# Altium schematic sheet xds100v2.SchDoc
size A4
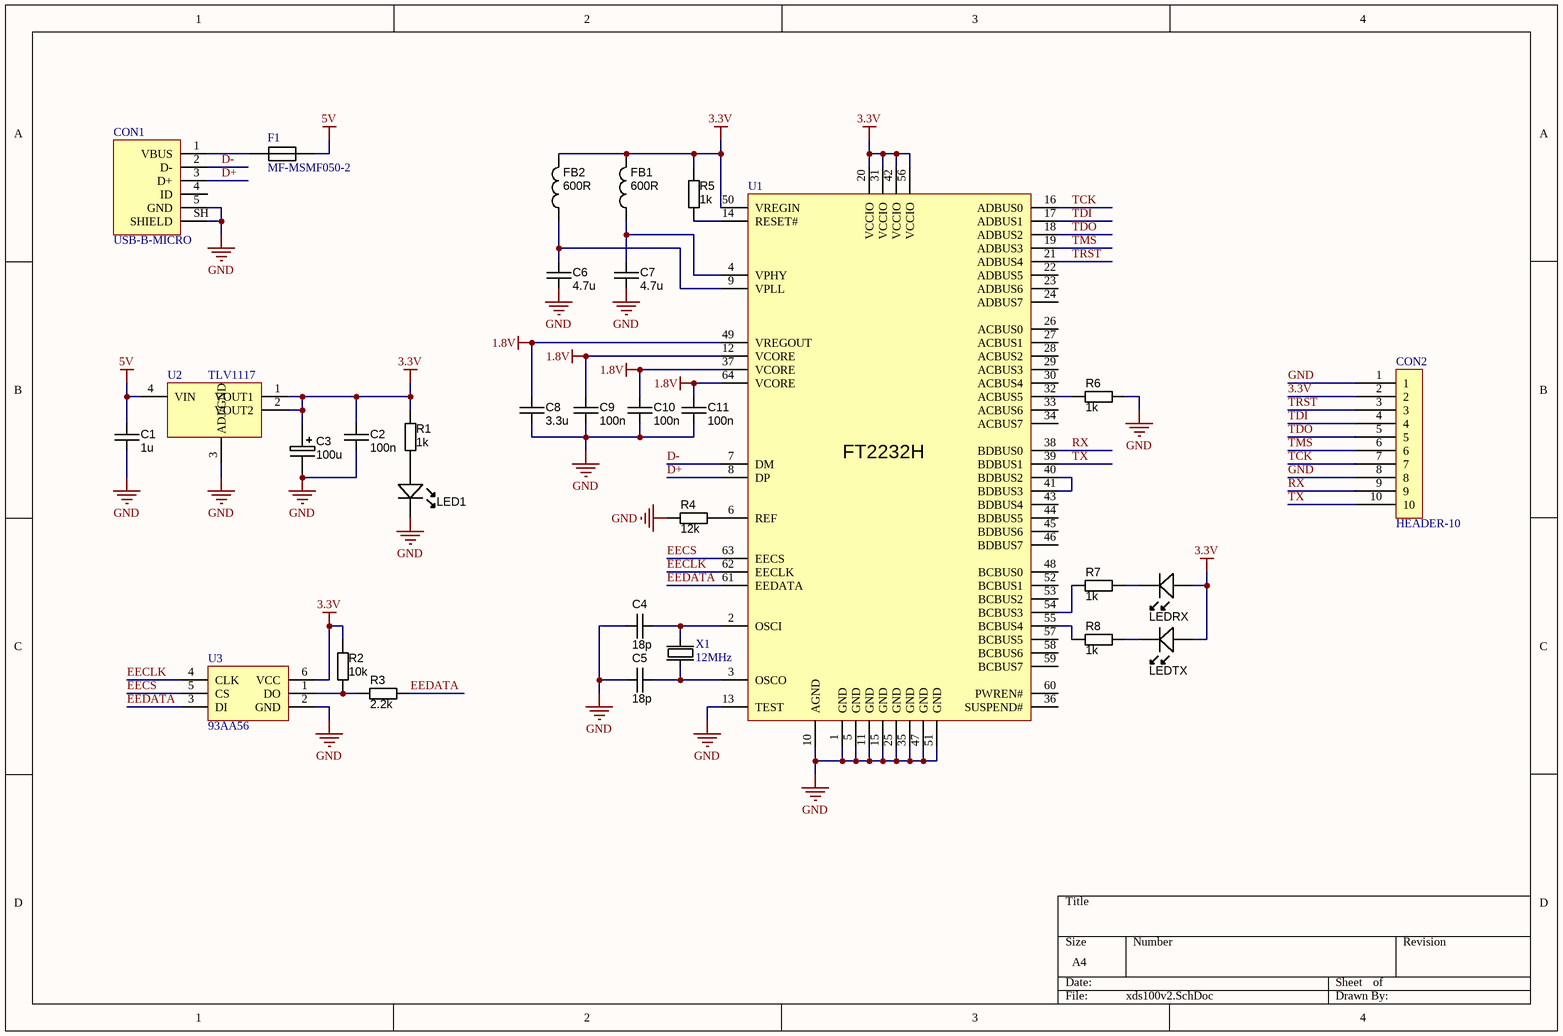
[diagram p0: xds100v2.SchDoc]

## Parts
C1  1u  [CAPC1608X90N]
C2  100n  [CAPC1608X90N]
C3  100u  [CAPMP3528X210N]
C4  18p  [CAPC1608X90N]
C5  18p  [CAPC1608X90N]
C6  4.7u  [CAPC1608X90N]
C7  4.7u  [CAPC1608X90N]
C8  3.3u  [CAPC1608X90N]
C9  100n  [CAPC1608X90N]
C10  100n  [CAPC1608X90N]
C11  100n  [CAPC1608X90N]
CON1  USB-B-MICRO  [USB-B-MICRO-FCI-10104110]
CON2  HEADER-10  [MICRO-MATCH-10]
F1  MF-MSMF050-2  [PTC-1218]
FB1  600R  [INDC1608N]
FB2  600R  [INDC1608N]
LED1  Green  [LED-0603-GREEN]  (value not drawn)
LEDRX  Green  [LED-0603-GREEN]  (value not drawn)
LEDTX  Green  [LED-0603-GREEN]  (value not drawn)
R1  1k  [RESC1608X55N]
R2  10k  [RESC1608X55N]
R3  2.2k  [RESC1608X55N]
R4  12k  [RESC1608X55N]
R5  1k  [RESC1608X55N]
R6  1k  [RESC1608X55N]
R7  1k  [RESC1608X55N]
R8  1k  [RESC1608X55N]
U1  FT2232H  [TSQFP50P1200X1200X160-64N]  (value not drawn)
U2  TLV1117  [SOT223]
U3  93AA56  [TSOT-23-6]
X1  12MHz  [XTAL-5x3.2]

## Nets
1.8V: C8.1 C9.2 C10.2 C11.2 U1.12(VCORE) U1.37(VCORE) U1.49(VREGOUT) U1.64(VCORE)
3.3V: C2.1 C3.1 CON2.2 FB1.2 FB2.2 LEDRX.A LEDTX.A R1.2 R2.2 R5.2 U1.20(VCCIO) U1.31(VCCIO) U1.42(VCCIO) U1.50(VREGIN) U1.56(VCCIO) U2.1(VOUT1) U2.2(VOUT2) U3.6(VCC)
5V: C1.2 F1.22 U2.4(VIN)
GND: C1.1 C2.2 C3.2 C4.2 C5.2 C6.2 C7.1 C8.2 C9.1 C10.1 C11.1 CON1.5(GND) CON1.SH(SHIELD) CON2.1 CON2.8 LED1.K R4.2 R6.2 U1.1(GND) U1.5(GND) U1.10(AGND) U1.11(GND) U1.13(TEST) U1.15(GND) U1.25(GND) U1.35(GND) U1.47(GND) U1.51(GND) U2.3(ADJ/GND) U3.2(GND)
D+: CON1.3(D+) U1.8(DP)
D-: CON1.2(D-) U1.7(DM)
EECLK: U1.62(EECLK) U3.4(CLK)
EECS: U1.63(EECS) U3.5(CS)
EEDATA: R3.1 U1.61(EEDATA) U3.3(DI)
RX: CON2.9 U1.38(BDBUS0)
TCK: CON2.7 U1.16(ADBUS0)
TDI: CON2.4 U1.17(ADBUS1)
TDO: CON2.5 U1.18(ADBUS2)
TMS: CON2.6 U1.19(ADBUS3)
TRST: CON2.3 U1.21(ADBUS4)
TX: CON2.10 U1.39(BDBUS1)
NetC4_1: C4.1 U1.2(OSCI) X1.1
NetC5_1: C5.1 U1.3(OSCO) X1.2
NetC6_1: C6.1 FB2.1 U1.9(VPLL)
NetC7_2: C7.2 FB1.1 U1.4(VPHY)
NetCON1_1: CON1.1(VBUS) F1.21
NetLED1_A: LED1.A R1.1
NetLEDRX_K: LEDRX.K R7.2
NetLEDTX_K: LEDTX.K R8.2
NetR2_1: R2.1 R3.2 U3.1(DO)
NetR4_1: R4.1 U1.6(REF)
NetR5_1: R5.1 U1.14(RESET#)
NetR6_1: R6.1 U1.32(ACBUS5)
NetR7_1: R7.1 U1.54(BCBUS3)
NetR8_1: R8.1 U1.55(BCBUS4)
NetU1_40: U1.40(BDBUS2) U1.41(BDBUS3)

Not connected (* = marked no-connect by the designer): CON1 4(ID); U1 22(ADBUS5) 23(ADBUS6) 24(ADBUS7) 26(ACBUS0) 27(ACBUS1) 28(ACBUS2) 29(ACBUS3) 30(ACBUS4) 33(ACBUS6) 34(ACBUS7) 36(SUSPEND#) 43(BDBUS4) 44(BDBUS5) 45(BDBUS6) 46(BDBUS7) 48(BCBUS0) 52(BCBUS1) 53(BCBUS2) 57(BCBUS5) 58(BCBUS6) 59(BCBUS7) 60(PWREN#)

## Library data of the parts
C1 C2 C4-C11 = CAPC_1u_0603_X7R_16V_10%: Capacitor SMD Cer 1uF 10% 16V X7R 0603; Manufacturer 1: TDK Corporation; Manufacturer Part Number 1: C1608X7R1C105K; Ratings: 16V; X7R; Material: ceramic; SCDType: spec; Value: 1µ; Package / Case: 0603 (1608 metric); Tolerance: ±10%; Supplier 1: Digi-Key; Supplier Part Number 1: 445-1604-1-ND; ComponentLink1URL: http://product.tdk.com/capacitor/mlcc/en/documents/mlcc_commercial_general_en.pdf; ComponentLink1Description: http://product.tdk.com/capacitor/mlcc/en/documents/mlcc_commercial_general_en.pdf
C3 = CAPT_100u_1210_6V3: Capacitor SMD Tantalum 100uF 20% 6.3V 1210; Manufacturer 1: AVX Corporation; Manufacturer Part Number 1: TCJB107M006R0045; Ratings: 6V3; Value: 100µ; SCDType: spec; Package / Case: 1210 (3528 Metric); Tolerance: ±20%; Material: Tantalum; Supplier 1: Digi-Key; Supplier Part Number 1: 478-4711-1-ND
F1 = MF-MSMF050-2: pin to pad: 21>1 22>2
FB1 FB2 = FERRITE_120R-100MHz_0603: Ferrite bead 120 Ohm at 100 MHz 2A 0603 SMD; Manufacturer 1: Murata Electronics North America; Manufacturer Part Number 1: BLM18PG121SN1D; Current: 900mA; DC Resistance (DCR): 172.9 mOhm Max; Frequency - Self Resonant: 23MHz; Frequency - Test: 100kHz; Impedance @ Frequency: 120 Ohm @ 100MHz; Filter Type: Differential Mode - Single; Number of Lines: 1; Ratings: 2 A; 50 mO DC; Value: 120R @ 100 MHz; SCDType: source; Current - Saturation: 900mA; Current - Temperature Rise: 900mA; Applications: Power Supplies; Package / Case: 1210 (3225 Metric); Operating Temperature: -40°C ~ 105°C; ComponentLink1URL: http://www.yuden.co.jp/ut/product/pdf/wound02_e.pdf; ComponentLink1Description: http://www.yuden.co.jp/ut/product/pdf/wound02_e.pdf; Supplier 1: Digi-Key; Supplier Part Number 1: 490-1037-1-ND; Current Rating: 2A; Mounting Type: Surface Mount; Height (Max): 0.037" (0.95mm); Size / Dimension: 0.063" L x 0.031" W (1.60mm x 0.80mm); ComponentLink2URL: http://search.murata.co.jp/Ceramy/image/img/PDF/ENG/L0110S0100BLM18P.pdf; ComponentLink2Description: http://search.murata.co.jp/Ceramy/image/img/PDF/ENG/L0110S0100BLM18P.pdf
LED1 = LED_SMD_Green_0603_570nm: LED 0603 SMD Green 570nm 50mcd 20mA; Manufacturer 1: Kingbright Company LLC; Manufacturer Part Number 1: APT1608CGCK; Material: AlGaInP; Ratings: 20mcd min; 50 mcd typ; 570 nm; Voltage - Forward (Vf) Typ: 2.1V; Viewing Angle: 120°; Lens Style/Size: Rectangle with Flat Top, 1.1mm x 0.8mm; Voltage - Forward (Vf) @ 10mA: 2.0V; SCDType: source; Wavelength - Peak: 574nm; Lens Type: Clear; Package / Case: 0603 (1608 metric); Color: Green; Current - Test: 20mA; Supplier 1: Digi-Key; Supplier Part Number 1: 754-1116-1-ND; RoHS 1: RoHS Compliant; Wavelength - Dominant: 570nm; ComponentLink1URL: http://www.us.kingbright.com/images/catalog/SPEC/APT1608CGCK.pdf; ComponentLink1Description: http://www.us.kingbright.com/images/catalog/SPEC/APT1608CGCK.pdf
LEDRX LEDTX = LED_SMD_Green_0603_570nm: LED 0603 SMD Green 570nm 50mcd 20mA; Manufacturer 1: Kingbright Company LLC; Manufacturer Part Number 1: APT1608CGCK; Ratings: 20mcd min; 50 mcd typ; 570 nm; Voltage - Forward (Vf) Typ: 2.1V; Viewing Angle: 120°; Lens Style/Size: Rectangle with Flat Top, 1.1mm x 0.8mm; Voltage - Forward (Vf) @ 10mA: 2.0V; SCDType: source; Wavelength - Peak: 574nm; Lens Type: Clear; Package / Case: 0603 (1608 metric); Material: AlGaInP; Color: Green; Current - Test: 20mA; Supplier 1: Digi-Key; Supplier Part Number 1: 754-1116-1-ND; RoHS 1: RoHS Compliant; Wavelength - Dominant: 570nm; ComponentLink1URL: http://www.us.kingbright.com/images/catalog/SPEC/APT1608CGCK.pdf; ComponentLink1Description: http://www.us.kingbright.com/images/catalog/SPEC/APT1608CGCK.pdf
R1-R8 = RES_1K_0603_1%: Resistor SMD chip 1k Ohm 0.1W 1% 0603; Manufacturer 1: Yageo; Manufacturer Part Number 1: RC0603FR-071KL; Ratings: 1/10W; SCDType: spec; Package / Case: 0603 (1608 Metric); Supplier 1: Digi-Key; Supplier Part Number 1: 311-1.00KHRCT-ND; Tolerance: ±1%; Value: 1K
U2 = TLV1117: pin to pad: 1>4 3>1 4>3
U3 = 93AA56: EEPROM
X1 = XTAL_5x3.2